# Altium project Project Power.PrjPcb (part 1 of 3)
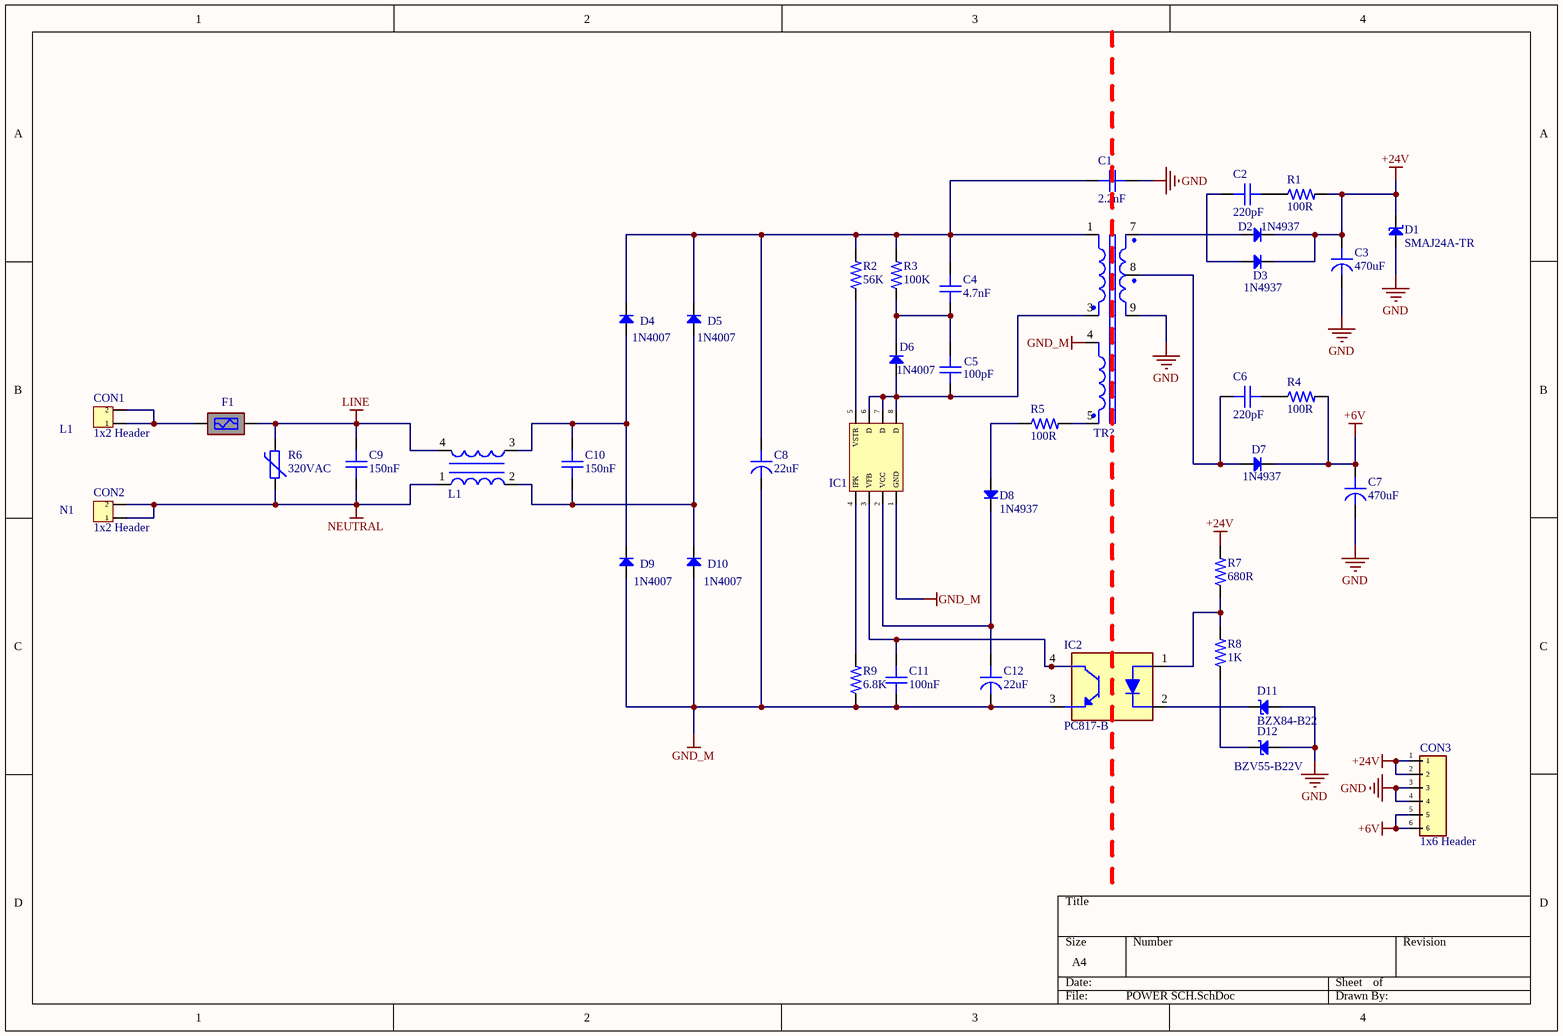
[diagram p0: POWER SCH.SchDoc]
1 sheet, 41 parts. Net scope: global (net labels, ports and power ports of the same name join across sheets).
Board file: POWER PCB.PcbDoc

## Sheet POWER SCH.SchDoc
size A4

### Parts
C1  2.2nF  [7.5X10MM]
C2  220pF  [2.54X5.5MM]
C3  470uF  [RAD5X10X16]
C4  4.7nF  [5.08X12.5MM]
C5  100pF  [5.08X12.5MM]
C6  220pF  [2.54X5.5MM]
C7  470uF  [RAD5X10X16]
C8  22uF  [RAD7.5X16X26]
C9  150nF  [MKPX2-15MM]
C10  150nF  [MKPX2-15MM]
C11  100nF  [CAPC2012X14N(0805)]
C12  22uF  [RAD2X5X11]
CON1  1x2 Header  [HEADER-1X2H]
CON2  1x2 Header  [HEADER-1X2H]
CON3  1x6 Header  [HEADER-1X6H]
D1  SMAJ24A-TR  [DO-214AC-NEVA]
D2  1N4937  [DO-41]
D3  1N4937  [DO-41]
D4  1N4007  [DO-41]
D5  1N4007  [DO-41]
D6  1N4007  [DO-41]
D7  1N4937  [DO-41]
D8  1N4937  [DO-41]
D9  1N4007  [DO-41]
D10  1N4007  [DO-41]
D11  BZX84-B22  [SOT23]
D12  BZV55-B22V  [SOD-80C]
F1  Fuse  [707001-FUSE HOLDER]  (value not drawn)
IC1  Switch  [DIP-8]  (value not drawn)
IC2  PC817-B  [DIP-4]
L1  Filter  [LİNE FİLTER 2x33MH]  (value not drawn)
R1  100R  [RESC3216X84N(1206)]
R2  56K  [RESC3216X84N(1206)]
R3  100K  [VERTICAL RES-AX0.7]
R4  100R  [RESC3216X84N(1206)]
R5  100R  [RESC3216X84N(1206)]
R6  320VAC  [VARISTOR-320V-10mm]
R7  680R  [RESC2013X70N(0805)]
R8  1K  [RESC2013X70N(0805)]
R9  6.8K  [AXIAL0.4]
TR?  Transformer  [TRAFO-24X25X18MM]  (value not drawn)

### Nets
+6V: C7.1 CON3.5 CON3.6 D7.2(K) R4.2
+24V: C3.1 CON3.1 CON3.2 D1.2(K) D2.2(K) D3.2(K) R1.2 R7.2
GND: C1.2 C3.2 C7.2 CON3.3 CON3.4 D1.1(A) D11.1(A) D12.1(A) TR?.9
GND_M: C8.2 C11.1 C12.2 D9.1(A) D10.1(A) IC1.1(GND) IC2.3(EMITTER) R9.1 TR?.4
LINE: C9.2 F1.2 L1.4 R6.2
NEUTRAL: C9.1 CON2.1 CON2.2 L1.1 R6.1
NetC1_1: C1.1 C4.2 C8.1 D4.2(K) D5.2(K) R2.2 R3.2 TR?.1
NetC2_1: C2.1 D3.1(A)
NetC2_2: C2.2 R1.1
NetC4_1: C4.1 C5.2 D6.2(K) R3.1
NetC5_1: C5.1 D6.1(A) IC1.6(D) IC1.7(D) IC1.8(D) TR?.3
NetC6_1: C6.1 D7.1(A) TR?.8
NetC6_2: C6.2 R4.1
NetC10_1: C10.1 D5.1(A) D10.2(K) L1.2(2ü)
NetC10_2: C10.2 D4.1(A) D9.2(K) L1.3
NetC11_2: C11.2 IC1.3(VFB) IC2.4(COLLECTOR)
NetC12_1: C12.1 D8.2(K) IC1.2(VCC)
NetCON1_1: CON1.1 CON1.2 F1.1
NetD2_1: D2.1(A) TR?.7
NetD8_1: D8.1(A) R5.1
NetD11_2: D11.2(K) IC2.2(CATHODE)
NetD12_2: D12.2(K) R8.1
NetIC1_4: IC1.4(IPK) R9.2
NetIC1_5: IC1.5(VSTR) R2.1
NetIC2_1: IC2.1(ANODE) R7.1 R8.2
NetR5_2: R5.2 TR?.5

### Notes on the sheet
- (near CON1) L1
- (near CON2) N1